# EAGLE design CH4D3M0 Shield (EAGLE 7.7.0)
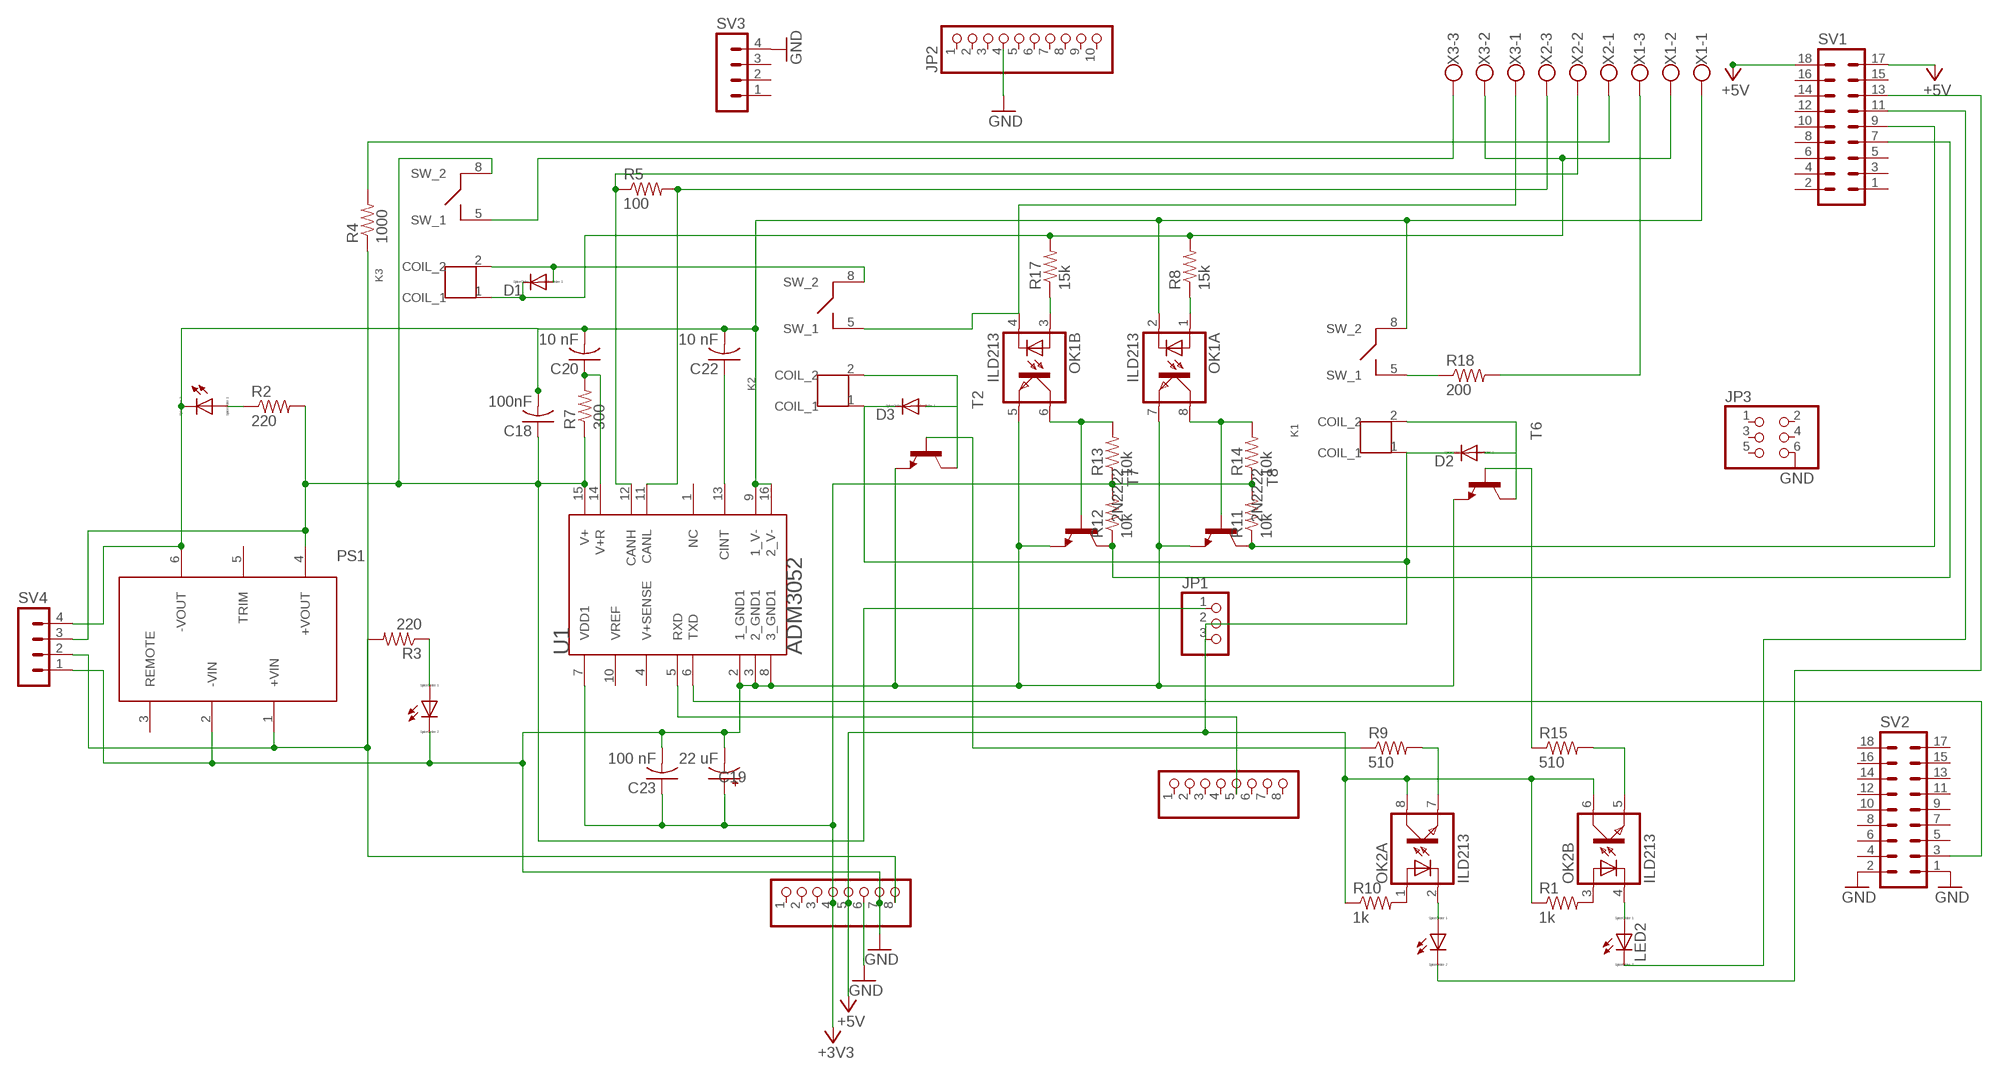
[diagram p0: schematic, sheet 1]

## Parts
ADCH  PINHD-1X8  [1X08]
ADCH2  PINHD-1X8  [1X08]
C18  100nF  C-US025-024X044  [C025-024X044]
C19  22 uF  CPOL-USE2.5-4V  [E2,5RE]
C20  10 nF  C-US025-024X044  [C025-024X044]
C22  10 nF  C-US025-024X044  [C025-024X044]
C23  100 nF  C-US025-024X044  [C025-024X044]
D1  DIODE-D-5  [D-5]
D2  DIODE-D-5  [D-5]
D3  DIODE-D-5  [D-5]
JP1  PINHD-1X3  [1X03]
JP2  PINHD-1X10  [1X10]
JP3  PINHD-2X3  [2X03]
K1  G6DN-1ATHROUGH_HOLE  [G6DN-1A]
K2  G6DN-1ATHROUGH_HOLE  [G6DN-1A]
K3  G6DN-1ATHROUGH_HOLE  [G6DN-1A]
LED1  LED_ELD260  [LED_LD260]
LED2  LED_ELD260  [LED_LD260]
LED3  LED_ELD260  [LED_LD260]
LED4  LED_ELD260  [LED_LD260]
OK1  ILD213  [SOIC08]
OK2  ILD213  [SOIC08]
PS1  JCMXXTHROUGH_HOLE  [JCMXX]
R1  1k  R-US_0204/7  [0204/7]
R2  220  R-US_0204/7  [0204/7]
R3  220  R-US_0204/7  [0204/7]
R4  1000  R-US_0204/7  [0204/7]
R5  100  R-US_0204/7  [0204/7]
R7  300  R-US_0204/7  [0204/7]
R8  15k  R-US_0204/7  [0204/7]
R9  510  R-US_0204/7  [0204/7]
R10  1k  R-US_0204/7  [0204/7]
R11  10k  R-US_0204/7  [0204/7]
R12  10k  R-US_0204/7  [0204/7]
R13  10k  R-US_0204/7  [0204/7]
R14  10k  R-US_0204/7  [0204/7]
R15  510  R-US_0204/7  [0204/7]
R17  15k  R-US_0204/7  [0204/7]
R18  200  R-US_0204/7  [0204/7]
SV1  MA09-2  [MA09-2]
SV2  MA09-2  [MA09-2]
SV3  MA04-1  [MA04-1]
SV4  MA04-1  [MA04-1]
T2  BC547-NPN-TO92-CBE  [TO92-CBE]
T6  BC547-NPN-TO92-CBE  [TO92-CBE]
T7  2N2222  [TO92-EBC-OVAL]
T8  2N2222  [TO92-EBC-OVAL]
U1  ANALOG_DEVICES_INC_ADM3052ANALOG_DEVICES_INC_ADM3052_0_0  [ANALOG_DEVICES_INC_ADM3052_0]
X1  W237-103  [W237-103]
X2  W237-103  [W237-103]
X3  W237-103  [W237-103]

## Nets
+3V3: ADCH2.4 C19.+ C23.1 R11.2 R12.2 R13.1 R14.1 U1.7(VDD1)
+5V: ADCH2.5 D2.C D3.C JP1.2 JP1.3 K1.1(COIL_1) K2.1(COIL_1) OK2.6(B:COL) OK2.8(A:COL) R1.1 R10.1 SV1.17 SV1.18
CAN_HIGH_DBLUE: R5.1 U1.12(CANH) X2.2
CAN_LOW_GREEN: R5.2 U1.11(CANL) X2.3
CINH_LBLUE: R18.2 X1.3
CNTF_YELLOW: R4.2 X2.1
CONTACTOR_NEG: D1.C K3.1(COIL_1) R8.2 R17.2 X1.2 X3.2
CONTACTOR_POS: K3.5(SW_1) X3.3
D1_F: R11.1 SV1.9 T8.C
D2_G: R12.1 SV1.7 T7.C
GND: ADCH2.6 ADCH2.7 C19.- C23.2 JP2.4 JP3.6 LED4.K(C) OK1.5(B:EMIT) OK1.7(A:EMIT) PS1.2(-VIN) SV2.1 SV2.2 SV3.4 SV4.1 T2.E T6.E T7.E T8.E U1.2(1_GND1) U1.3(2_GND1) U1.8(3_GND1)
HGND: C18.2 C20.2 C22.2 K1.8(SW_2) LED3.K(C) OK1.2(A:C) PS1.6(-VOUT) SV4.4 U1.9(1_V-) U1.16(2_V-) X1.1
N$2: C18.1 JP1.1 K3.8(SW_2) PS1.4(+VOUT) R2.2 R7.1 SV4.3 U1.15(V+)
N$3: C20.1 R7.2 U1.14(V+R)
N$4: C22.1 U1.13(CINT)
N$5: ADCH2.8 PS1.1(+VIN) R3.2 R4.1 SV4.2
N$6: ADCH.5 U1.5(RXD)
N$10: K1.5(SW_1) R18.1
N$12: OK1.1(A:A) R8.1
N$13: OK1.3(B:A) R17.1
N$15: D1.A K2.8(SW_2) K3.2(COIL_2)
N$17: OK1.6(B:COL) R13.2 T7.B
N$18: OK1.8(A:COL) R14.2 T8.B
N$20: SV2.3 U1.6(TXD)
N$23: D2.A K1.2(COIL_2) T6.C
N$24: D3.A K2.2(COIL_2) T2.C
N$25: OK2.7(A:EMIT) R9.2
N$26: LED1.A OK2.2(A:C)
N$27: OK2.1(A:A) R10.2
N$28: OK2.3(B:A) R1.2
N$29: R9.1 T2.B
N$30: LED1.K(C) SV1.13
N$31: R15.1 T6.B
N$32: OK2.5(B:EMIT) R15.2
N$33: LED2.A OK2.4(B:C)
N$34: LED2.K(C) SV1.11
N$36: LED3.A R2.1
N$37: LED4.A R3.1
S2_10_WHITE: K2.5(SW_1) OK1.4(B:C) X3.1
Unconnected: ADCH2.1 ADCH2.2 ADCH2.3 ADCH.1 ADCH.2 ADCH.3 ADCH.4 ADCH.6 ADCH.7 ADCH.8 JP2.1 JP2.2 JP2.3 JP2.5 JP2.6 JP2.7 JP2.8 JP2.9 JP2.10 JP3.1 JP3.2 JP3.3 JP3.4 JP3.5 PS1.3(REMOTE) PS1.5(TRIM) SV1.1 SV1.2 SV1.3 SV1.4 SV1.5 SV1.6 SV1.8 SV1.10 SV1.12 SV1.14 SV1.15 SV1.16 SV2.4 SV2.5 SV2.6 SV2.7 SV2.8 SV2.9 SV2.10 SV2.11 SV2.12 SV2.13 SV2.14 SV2.15 SV2.16 SV2.17 SV2.18 SV3.1 SV3.2 SV3.3 U1.1(NC) U1.4(V+SENSE) U1.10(VREF)

## Library data of the parts
ADCH ADCH2 = pinhead1:PINHD-1X8: PIN HEADER
C18 C20 C22 C23 = rcl:C-US: CAPACITOR, American symbol
C19 = rcl:CPOL-US: POLARIZED CAPACITOR, American symbol
D1-D3 = diode:DIODE-: DIODE
JP1 = adafruit:PINHD-1X3: PIN HEADER
JP2 = pinhead1:PINHD-1X10: PIN HEADER
JP3 = pinhead1:PINHD-2X3: PIN HEADER
K1-K3 = G6DN-1A:G6DN-1A: Generic OMRON Mini-Relay footprint
LED1-LED4 = eagle-ltspice:LED_E: LED Source: http://www.osram.convergy.de Source: www.luxeon.com Source: www.kingbright.com; SPICEMODEL: NONE; SPICEPREFIX: D; SPICETYPE: diode
OK1 OK2 = optocoupler:ILD2*: Siemens ILD205/206/207/211/213/217 DUAL PHOTOTRANSISTOR SMALL OUTLINE SURFACE MOUNT OPTOCOUPLER Source: 153385-da-01-en-Optocoupler_ILD205-T.pdf; MF: VISHAY/TELEFUNKEN; MPN: ILD213T; OC_FARNELL: 1045451; OC_NEWARK: 20H8680
PS1 = JCMxx:JCMXX: 1.6kV Isolated DC to DC converter (8-18V in, 5V out)
R1-R5 R7-R15 R17 R18 = rcl:R-US_: RESISTOR, American symbol
SV1 SV2 = con-lstb:MA09-2: PIN HEADER; OC_FARNELL: unknown; OC_NEWARK: unknown
SV3 SV4 = con-lstb1:MA04-1: PIN HEADER; OC_FARNELL: unknown; OC_NEWARK: unknown
T2 T6 = transistor1:*-NPN-: NPN Transistror BF959 corrected 2008.03.06
T7 T8 = adafruit1:2N2222: NPN TRANSISTOR Big oval pads
U1 = Analog Devices Inc - ADM3052:ANALOG_DEVICES_INC_ADM3052: Isolated CAN Transceiver with Integrated High Voltage, Bus-Side, Linear Regulator; CENTROID_NOT_SPECIFIED: No; DATASHEET: http://www.analog.com/media/en/technical-documentation/data-sheets/ADM3052.pdf; DIGIKEY_DESCRIPTION: IC DGTL ISOLATOR 5KV 3CH CAN 16SOIC; DIGIKEY_PART_NUMBER: ADM3052BRWZ-REEL7; IPC_LAND_PATTERN_NAME: SOIC127P1032X250-16; LEAD_FREE: yes; MF: Analog Devices Inc; MFG_PACKAGE_IDENT: RW-16; MOUSER_PART_NUMBER: 584-ADM3052BRWZ-R7; MPN: ADM3052; PACKAGE: SOIC-16; PREFIX: U; ROHS: yes; TEMPERATURE_RANGE_HIGH: +85°C; TEMPERATURE_RANGE_LOW: -40°C
X1-X3 = con-wago-500_1:W237-103: WAGO SCREW CLAMP; MPN: 237-103; OC_FARNELL: unknown; OC_NEWARK: 18M7116

## Net classes
0 default: width 0.15 mm, drill 0.3 mm, clearance 0.205 mm

## Board
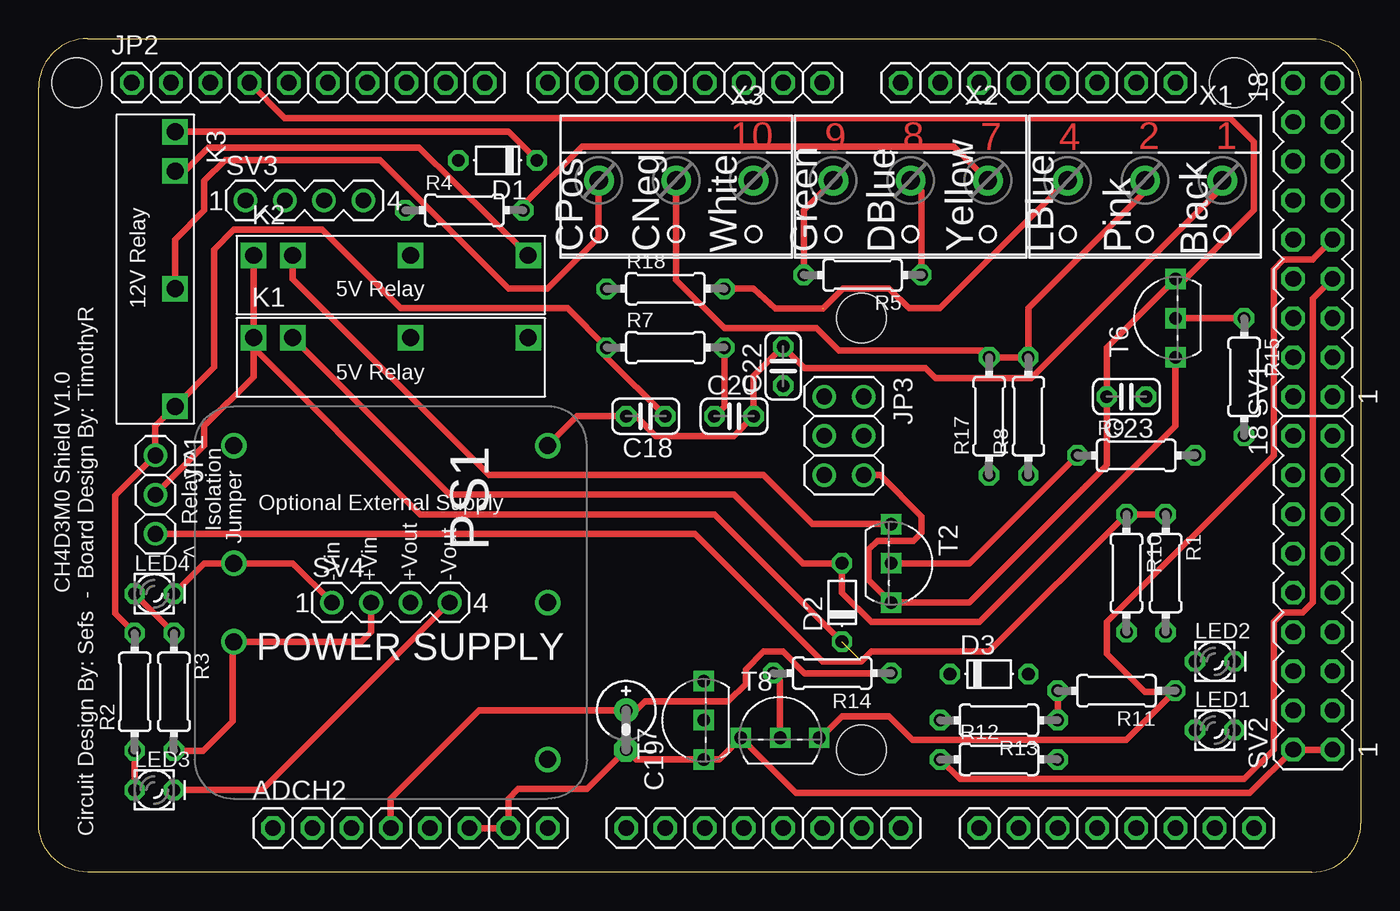
[diagram p1: board, top side]
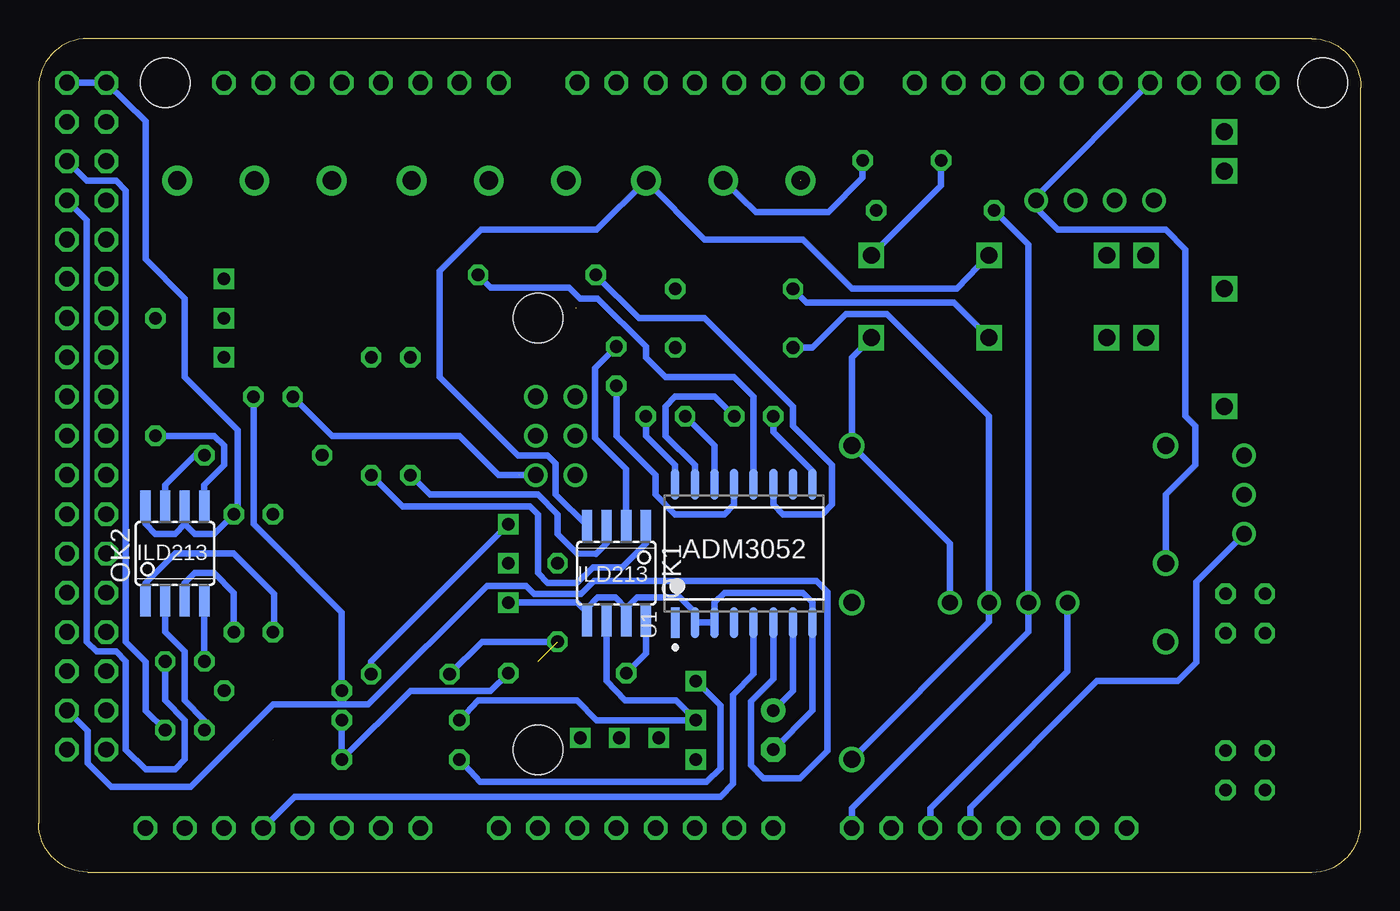
[diagram p2: board, bottom side, seen from below]

Size 85.6 x 53.97 mm. Coordinates in mm from the lower left corner, seen from the top.
Outline: 3.18,53.97 arc90 0,50.8 0,3.18 arc90 3.18,0 82.42,0 arc90 85.6,3.18 85.6,50.8 arc90 82.42,53.97 3.18,53.97
Copper layers (1*16): Top 0.035mm / dielectric 1.5mm / Bottom 0.035mm
Design rules "default *": minimum track width 0.15mm, minimum drill 0.3mm, track to track 0.15mm, track to pad 0.15mm, pad to pad 0.15mm, via to via 0.15mm, smd to smd 0.15mm, copper to edge 0.6mm, drill to drill 0.3mm, minimum pad ring 10mil, minimum via ring 10mil, stop-mask expansion 2mil, vias tented up to drill 1mil, thermal gap 10mil
Holes 3.2 mm at 2.48,51.12 77.41,51.12 53.28,35.88 53.28,7.94

### Footprints (pad centres in the part's own frame; a part is rotated, then mirrored left to right if it is on the bottom)
1X08 = drill 1.016 octagon: 1 -8.89,0; 2 -6.35,0; 3 -3.81,0; 4 -1.27,0; 5 1.27,0; 6 3.81,0; 7 6.35,0; 8 8.89,0
C025-024X044 = drill 0.813 octagon: 1 -1.27,0; 2 1.27,0
E2,5RE = drill 0.813 pad 1.575: + -1.27,0 | drill 0.813 pad 1.575 octagon: - 1.27,0
D-5 = drill 0.813 octagon: A 2.54,0; C -2.54,0
1X03 = drill 1.016: 1 -2.54,0; 2 0,0; 3 2.54,0
1X10 = drill 1.016 octagon: 1 -11.43,0; 2 -8.89,0; 3 -6.35,0; 4 -3.81,0; 5 -1.27,0; 6 1.27,0; 7 3.81,0; 8 6.35,0; 9 8.89,0; 10 11.43,0
2X03 = drill 1.016: 1 -2.54,-1.27; 2 -2.54,1.27; 3 0,-1.27; 4 0,1.27; 5 2.54,-1.27; 6 2.54,1.27
G6DN-1A = drill 1.1 square: 1 -8.89,1.27; 2 -6.35,1.27; 5 1.27,1.27; 8 8.89,1.27
LED_LD260 = drill 0.813 octagon: A -1.27,0; K 1.27,0
SOIC08 = smd 0.66 x 2.032: 1 -1.905,-3.073; 2 -0.635,-3.073; 3 0.635,-3.073; 4 1.905,-3.073; 5 1.905,3.073; 6 0.635,3.073; 7 -0.635,3.073; 8 -1.905,3.073
JCMXX = drill 1.1: 1 2.54,-10.16; 2 -2.54,-10.16; 3 -10.16,-10.16; 4 10.16,10.16; 5 0,10.16; 6 -10.16,10.16
0204/7 = drill 0.813 octagon: 1 -3.81,0; 2 3.81,0
MA09-2 = drill 1.016 octagon: 1 -10.16,-1.27; 2 -10.16,1.27; 3 -7.62,-1.27; 4 -7.62,1.27; 5 -5.08,-1.27; 6 -5.08,1.27; 7 -2.54,-1.27; 8 -2.54,1.27; 9 0,-1.27; 10 0,1.27; 11 2.54,-1.27; 12 2.54,1.27; 13 5.08,-1.27; 14 5.08,1.27; 15 7.62,-1.27; 16 7.62,1.27; 17 10.16,-1.27; 18 10.16,1.27
MA04-1 = drill 1.016: 1 -3.81,0; 2 -1.27,0; 3 1.27,0; 4 3.81,0
TO92-CBE = drill 0.813 square: B 0,0; C -2.54,0; E 2.54,0
TO92-EBC-OVAL = drill 0.813 square: B 0,-1.27; C 2.54,-1.27; E -2.54,-1.27
ANALOG_DEVICES_INC_ADM3052_0 = smd 1.998 x 0.542: 1 -4.478,4.445; 2 -4.478,3.175; 3 -4.478,1.905; 4 -4.478,0.635; 5 -4.478,-0.635; 6 -4.478,-1.905; 7 -4.478,-3.175; 8 -4.478,-4.445; 9 4.478,-4.445; 10 4.478,-3.175; 11 4.478,-1.905; 12 4.478,-0.635; 13 4.478,0.635; 14 4.478,1.905; 15 4.478,3.175; 16 4.478,4.445
W237-103 = drill 1.194 pad 1.93: 1 -5,-1.29; 2 0,-1.29; 3 5,-1.29

### Placement (x,y rotation side)
ADCH  69.79,2.86 0 top
ADCH2  24.07,2.86 0 top
ADCL  [1X08]  46.93,2.86 0 top
C18  39.31,29.53 180 top
C19  38.04,9.21 270 top
C20  45.02,29.53 0 top
C22  48.2,32.77 90 top
C23  70.42,30.8 180 top
COMMUNICATION  [1X08]  64.71,51.12 180 top
D1  29.72,46.1 180 top
D2  52.01,17.46 90 top
D3  61.53,12.83 0 top
JP1  7.56,24.45 270 top
JP2  17.46,51.12 0 top
JP3  52.13,28.26 270 top
K1  22.8,33.34 0 top
K2  22.8,38.67 0 top
K3  7.56,39.05 270 top
LED1  76.14,9.21 0 top
LED2  76.14,13.65 0 top
LED3  7.49,5.33 0 top
LED4  7.49,18.03 0 top
OK1  48.2,19.37 180 bottom
OK2  76.77,20.64 0 bottom
PS1  22.8,17.46 270 top
PWML  [1X08]  41.85,51.12 180 top
R1  72.96,19.37 270 top
R2  6.22,11.68 90 top
R3  8.76,11.68 270 top
R4  27.56,42.86 0 top
R5  53.34,38.67 180 top
R7  40.58,33.97 0 top
R8  64.07,29.53 90 top
R9  71.06,26.99 0 top
R10  70.42,19.37 270 top
R11  69.78,11.75 180 top
R12  62.17,7.3 0 top
R13  62.17,9.84 180 top
R14  51.37,12.89 180 top
R15  78.04,32.07 270 top
R17  61.53,29.53 90 top
R18  40.58,37.78 0 top
SV1  82.49,40.96 90 top
SV2  82.49,18.1 90 top
SV3  17.21,43.5 0 top
SV4  22.8,17.46 0 top
T2  55.18,20 270 top
T6  73.6,35.88 90 top
T7  41.78,9.84 90 top
T8  48.01,9.97 0 top
U1  39.94,20.64 90 bottom
X1  71.63,43.5 180 top
X2  56.45,43.5 180 top
X3  41.27,43.5 180 top

### Tracks (layer width: path | path; a pad name or v marks a point on that pad's centre or on a via)
+3V3
  Top 0.406: R14.1 49.59,12.89 48.2,14.29 46.93,14.29 45.78,13.14 45.78,12.19 44.64,11.05 39.24,11.05 38.67,10.48 C19.+ 28.51,10.48 22.8,4.76 ADCH2.4 | R13.1 65.98,11.11 R11.2
  Bottom 0.406: C23.1 71.69,22.54 65.98,16.83 65.98,14.29 R11.2 | U1.7 36.77,11.75 C19.+ | R13.1 R12.2 61.53,11.75 56.32,11.75 R14.1
+5V  (1 unrouted)
  Top 0.406: R1.1 R10.1 61.53,14.29 53.91,14.29 53.28,13.65 50.74,13.65 42.48,21.91 JP1.3 | D2.C 43.75,23.18 24.7,23.18 13.91,33.97 K1.1 | JP1.2 10.73,27.62 10.73,28.89 13.91,32.07 K1.1 | K2.1 K1.1
  Bottom 0.15: 76.16,23.68 OK2.6 | 78.68,23.18 OK2.8 | 25.3,2.9 ADCH2.5
  Bottom 0.406: 78.68,23.18 78.68,22.54 78.04,21.91 76.77,21.91 76.14,22.54 | 76.14,22.54 75.5,21.91 74.23,21.91 R1.1 72.71,23.43 72.71,28.64 76.14,32.07 76.14,37.15 78.68,39.69 78.68,48.64 SV1.18 SV1.17 | 76.14,22.54 76.01,23.07 OK2.6 | 25.3,2.9 25.29,4.17 17.08,12.38 11.86,12.38 10.66,13.58 10.66,18.8 JP1.3 | D2.C 56.9,14.92 D3.C
CAN_HIGH_DBLUE
  Top 0.406: R5.1 57.15,44.09 X2.2
  Bottom 0.15: 39.31,25.08 U1.12
  Bottom 0.406: 39.31,25.08 39.31,30.8 40.58,32.07 45.02,32.07 46.29,33.34 46.29,34.04 49.4,37.15 50.55,37.15 51.24,37.85 56.32,37.85 R5.1
CAN_LOW_GREEN
  Top 0.406: R5.2 49.53,42.87 X2.3
  Bottom 0.406: U1.11 38.04,23.81 37.4,23.18 34.86,23.18 34.23,23.81 34.23,26.35 36.77,28.89 36.77,30.16 42.48,35.88 46.74,35.88 R5.2
CINH_LBLUE  (1 unrouted)
  Top 0: 58.36,36.51 | 55.12,37.72 55.12,37.85 55.05,37.78 | 50.8,36.51 50.55,36.51
  Top 0.15: X1.3 66.83,44.79 66.61,44.77
  Top 0.406: 66.61,44.77 58.36,36.51 | R18.2 46.29,37.78 47.69,36.49 50.78,36.49 52.07,37.78 55.05,37.78 | 58.36,36.51 56.32,36.51 55.12,37.72
CNTF_YELLOW
  Top 0.406: R4.2 31.37,43.18 35.18,46.99 59.25,46.99 X2.1
CONTACTOR_NEG
  Top 0: 61.09,33.78 | 50.36,35.24 50.29,35.24
  Top 0.15: X3.2 41.27,44.79 41.27,44.77
  Top 0.406: X1.2 71.63,44.07 64.07,36.51 R8.2 R17.2 61.09,33.78 | 41.27,44.77 41.27,38.35 44.39,35.24 50.29,35.24 | 61.09,33.78 51.82,33.78 50.36,35.24 | K3.1 30.42,47.94 D1.C
  Bottom 0.406: 41.19,44.79 X3.2 39.16,42.74 34.48,42.74 32.26,44.96 D1.C
CONTACTOR_POS  (1 unrouted)
  Top 0.406: K3.5 8.83,40.96 10.73,42.86 10.73,44.77 12.06,46.1 22.1,46.1 30.42,37.78 32.96,37.78 36.26,41.08 36.26,44.77
D1_F  (1 unrouted)
  Top 0.406: SV1.9 82.49,39.69 82.49,39.67 80.58,39.67 79.95,39.03 79.95,26.99 69.15,16.19 69.15,14.15 71.62,11.68 73.52,11.68 R11.1 70.41,8.57 56.58,8.57 55.05,10.1 52.01,10.1 50.61,8.7 T8.C
  Bottom 0: 70.42,8.57 | 50.61,8.7 T8.C
D2_G
  Top 0.406: R12.1 59.63,6.03 78.04,6.03 79.95,7.94 79.95,16.19 80.58,16.83 81.85,16.83 82.49,17.46 82.49,37.15 SV1.7
  Bottom 0.406: R12.1 57.02,5.84 42.35,5.84 41.46,6.73 41.47,9.02 41.47,10.8 T7.C
GND  (1 unrouted)
  Top 0.406: JP2.4 15.94,48.83 77.15,48.83 78.68,47.31 78.68,42.86 74.23,38.42 T6.E 69.15,33.97 C23.2 69.15,26.35 60.26,17.46 T2.E 53.72,18.92 53.72,20.89 54.29,21.46 56.64,21.46 57.15,21.97 57.15,23.05 54.48,25.72 | SV2.1 SV2.2 78.42,5.14 49.02,5.14 T8.E 44.07,7.3 T7.E 38.67,7.3 C19.- 35.5,5.4 31.05,5.4 30.42,4.76 ADCH2.7 ADCH2.6 | SV4.1 16.45,20 PS1.2 10.73,20 LED4.K | 54.48,25.72 JP3.6
  Bottom 0.15: 12.7,20.12 PS1.2 | 14.12,50.65
  Bottom 0.406: U1.2 U1.3 41.85,17.46 41.21,18.1 36.13,18.1 35.5,17.46 U1.8 35.5,10.48 C19.- | 14.12,50.65 14.1,50.67 | C23.2 66.61,28.26 58.36,28.26 55.82,25.72 JP3.6 | PS1.2 12.64,24.45 10.73,26.35 10.73,28.89 11.37,29.53 11.37,40.32 12.64,41.59 19.62,41.59 21.02,42.99 SV3.4 21.02,43.75 JP2.4 14.12,50.65 | ADCH2.6 27.88,4.13 18.99,13.02 SV4.1 | T2.E 50.74,17.46 50.1,16.83 OK1.5 50.1,17.08 49.4,17.78 48.26,17.78 47.56,17.08 | 47.56,17.08 46.86,17.78 44.07,17.78 43.12,16.83 43.12,16.13 | OK1.7 47.56,17.08
HGND
  Top 0.406: PS1.6 34.86,29.53 C18.2 38.67,29.53 39.94,28.26 45.02,28.26 C20.2 46.29,32.13 C22.2 49.59,32.64 57.4,32.64 58.04,32 64.26,32 76.63,44.37 X1.1 | LED3.K 14.47,5.33 SV4.4
  Bottom 0.15: 35.5,25.08 U1.9
  Bottom 0.406: C20.2 46.29,28.26 44.39,26.35 U1.16 | C18.2 38.04,28.51 35.5,25.97 U1.9 | SV4.4 26.61,21.27 PS1.6 32.96,33.34 K1.8 | 48.83,33.4 C22.2 49.59,32.64 49.59,28.13 47.56,26.1 OK1.2
N$2
  Top 0.406: C18.1 36.77,33.34 R7.1 34.23,36.51 arc1 23.43,36.51 18.35,41.59 12.64,41.59 11.37,40.32 11.37,32.7 K3.8 7.56,28.89 JP1.1 4.95,24.38 4.95,16.76 R2.2
  Bottom 0.15: 32.93,7.34 PS1.4
  Bottom 0.406: U1.15 43.12,26.35 45.02,28.26 45.02,30.16 44.39,30.8 41.85,30.8 C18.1 | R7.1 35.5,33.97 33.34,36.13 30.67,36.13 24.07,29.53 SV4.3 24.07,16.19 PS1.4
N$3
  Top 0.15: 44.39,33.79 R7.2
  Top 0.406: 44.39,33.79 44.39,30.16 C20.1
  Bottom 0.15: 41.85,25.08 U1.14
  Bottom 0.406: 41.85,25.08 41.85,27.62 C20.1
N$4
  Bottom 0.406: C22.1 48.2,28.26 45.66,25.72 45.66,24.45 44.39,23.18 41.21,23.18 40.58,23.81 U1.13
N$5
  Top 0.406: SV4.2 21.53,15.56 20.89,14.92 PS1.1 12.57,14.85 12.57,9.77 10.66,7.87 R3.2
  Bottom 0.406: ADCH2.8 32.96,4.13 21.53,15.56 SV4.2 21.53,40.64 R4.1
N$6
  Bottom 0.406: ADCH.5 69.02,4.89 41.47,4.89 40.64,5.71 40.64,11.49 39.31,12.83 U1.5
N$10
  Bottom 0.406: K1.5 26.35,36.89 35.88,36.89 R18.1
N$12
  Bottom 0.406: R8.1 62.04,23.67 53.78,23.68 53.28,23.18 53.28,19.37 52.64,18.73 50.74,18.73 49.72,19.75 47.81,19.75 46.29,21.27 OK1.1
N$13
  Bottom 0.406: R17.1 60.26,24.45 53.28,24.45 52.01,23.18 52.01,21.91 50.74,20.64 49.52,20.62 48.83,21.27 OK1.3
N$15
  Top 0.406: K3.2 9.46,45.4 10.98,46.93 24.64,46.93 K2.8
  Bottom 0.406: D1.A 27.18,44.45 K2.8
N$17
  Bottom 0.406: R13.2 57.15,11.11 50.74,11.11 49.47,9.84 T7.B 44.32,11.11 47.62,11.11 48.83,12.38 OK1.6
N$18
  Top 0.406: R14.2 48.01,12.38 T8.B
  Bottom 0.406: R14.2 46.29,14.16 OK1.8
N$20
  Bottom 0.406: U1.6 38.04,12.51 39.5,11.05 39.5,6.92 38.67,6.1 36.32,6.1 34.54,7.87 34.54,18.16 35.24,18.86 49.66,18.86 50.48,18.03 53.53,18.03 54.04,18.54 56.58,18.54 64.26,10.86 70.42,10.86 75.76,5.52 80.9,5.52 82.42,7.05 82.42,9.14 SV2.3
N$23
  Top 0.406: T6.C 73.6,28.89 60.9,16.19 53.91,16.19 52.01,18.1 D2.A 49.47,20 45.02,24.45 26.61,24.45 K1.2
N$24
  Top 0.406: K2.2 16.45,38.42 29.15,25.72 46.93,25.72 50.1,22.54 T2.C
  Bottom 0.406: D3.A 64.07,13.65 T2.C
N$25
  Bottom 0.15: 77.41,24.45 77.23,23.85 OK2.7
  Bottom 0.406: R9.2 75.5,26.99 77.41,25.08 77.41,24.45
N$26
  Bottom 0.15: 77.23,17.46 OK2.2
  Bottom 0.406: OK2.2 77.41,15.56 76.14,14.29 76.14,11.11 74.87,9.84 LED1.A
N$27
  Bottom 0.15: 78.68,18.1 78.47,17.64 OK2.1
  Bottom 0.406: 78.68,18.1 78.68,18.73 76.77,20.64 72.96,20.64 70.35,18.03 70.35,15.62 R10.2
N$28
  Bottom 0.15: 76.14,18.1 75.99,17.64 OK2.3
  Bottom 0.406: R1.2 72.96,18.1 74.23,19.37 75.5,19.37 76.14,18.73 76.14,18.1
N$29
  Top 0.406: R9.1 60.26,20 T2.B
N$30
  Bottom 0.406: LED1.K 78.68,10.46 78.68,13.63 79.95,14.9 79.95,44.13 80.58,44.77 82.49,44.77 SV1.13
N$31
  Top 0.406: T6.B R15.1
N$32
  Bottom 0.15: 74.87,23.81 OK2.5
  Bottom 0.406: 74.87,23.81 74.87,25.08 73.6,26.35 73.6,27.62 74.23,28.26 R15.2
N$33
  Bottom 0.15: 74.74,17.46 OK2.4
  Bottom 0.406: LED2.A OK2.4
N$34
  Bottom 0.406: LED2.K 77.41,11.11 76.14,9.84 76.14,7.3 76.77,6.67 78.68,6.67 79.95,7.94 79.95,13.65 80.58,14.29 81.85,14.29 82.49,14.92 82.49,42.23 SV1.11
N$36
  Top 0.406: R2.1 LED3.A
N$37
  Top 0.406: LED4.A R3.1
S2_10_WHITE
  Bottom 0.406: K2.5 26.16,37.78 32.96,37.78 36.13,40.96 42.48,40.96 46.29,44.77 X3.1 49.47,41.59 56.96,41.59 59.63,38.93 59.63,32.07 54.55,26.99 52.64,26.99 52.13,26.48 52.13,24.47 OK1.4

### Text on the board
Top: 10 | 9 | 8 | 7 | 4 | 2 | 1
tPlace: 12V Relay | CPos | CNeg | Yellow | White | Green | DBlue | LBlue | Pink | Black | 5V Relay | 5V Relay | < | Isolation | Relay | Optional External Supply | < | Jumper | -Vin | +Vin | +Vout | -Vout | CH4D3M0 Shield V1.0 | POWER SUPPLY | Circuit Design By: Sefs - Board Design By: TimothyR
bPlace: ADM3052 | ILD213 | ILD213